# EAGLE schematic untitled (EAGLE 9.5.1)

## Sheet 1 of 3
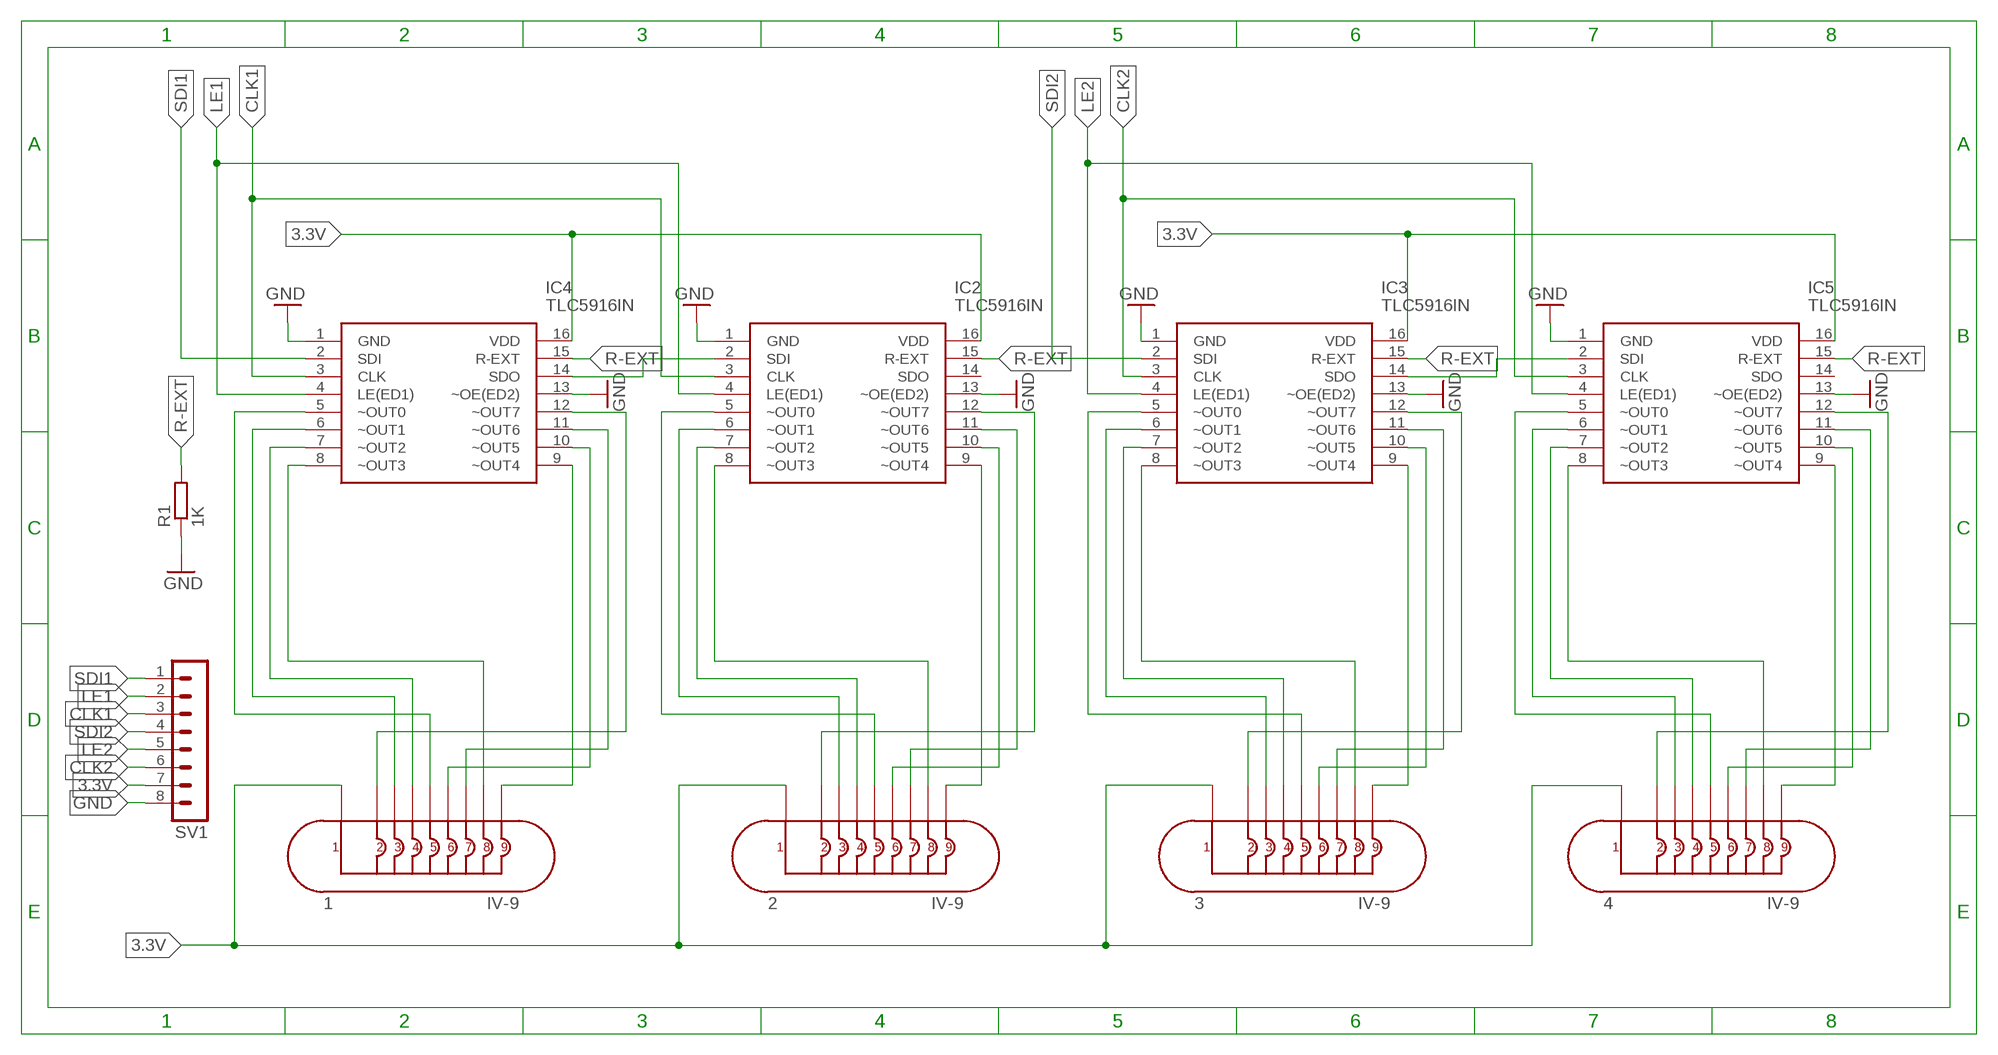
[diagram p0: schematic, sheet 1]

### Parts
1  IV-9  [IV-9]
2  IV-9  [IV-9]
3  IV-9  [IV-9]
4  IV-9  [IV-9]
IC2  TLC5916IN  [DIP254P762X508-16]
IC3  TLC5916IN  [DIP254P762X508-16]
IC4  TLC5916IN  [DIP254P762X508-16]
IC5  TLC5916IN  [DIP254P762X508-16]
R1  1K  R-EU_R1206  [R1206]
SV1  MA08-1  [MA08-1]

### Nets
3.3V: 1.1 2.1 3.1 4.1 IC2.16(VDD) IC3.16(VDD) IC4.16(VDD) IC5.16(VDD) SV1.7
CLK1 [other]: IC2.3(CLK) IC4.3(CLK) SV1.3
CLK2 [other]: IC3.3(CLK) IC5.3(CLK) SV1.6
GND: IC2.1(GND) IC2.13(~OE(ED2)) IC3.1(GND) IC3.13(~OE(ED2)) IC4.1(GND) IC4.13(~OE(ED2)) IC5.1(GND) IC5.13(~OE(ED2)) R1.1 SV1.8
LE1 [other]: IC2.4(LE(ED1)) IC4.4(LE(ED1)) SV1.2
LE2 [other]: IC3.4(LE(ED1)) IC5.4(LE(ED1)) SV1.5
N$7 [other]: IC3.14(SDO) IC5.2(SDI)
N$9 [other]: IC2.2(SDI) IC4.14(SDO)
N$13 [other]: 2.8 IC2.8(~OUT3)
N$15 [other]: 1.5 IC4.5(~OUT0)
N$16 [other]: 1.3 IC4.6(~OUT1)
N$17 [other]: 1.4 IC4.7(~OUT2)
N$18 [other]: 1.8 IC4.8(~OUT3)
N$19 [other]: 1.9 IC4.9(~OUT4)
N$20 [other]: 1.6 IC4.10(~OUT5)
N$21 [other]: 1.7 IC4.11(~OUT6)
N$22 [other]: 3.5 IC3.5(~OUT0)
N$23 [other]: 3.3 IC3.6(~OUT1)
N$24 [other]: 3.4 IC3.7(~OUT2)
N$25 [other]: 3.6 IC3.10(~OUT5)
N$26 [other]: 3.7 IC3.11(~OUT6)
N$27 [other]: 3.2 IC3.12(~OUT7)
N$28 [other]: 4.5 IC5.5(~OUT0)
N$29 [other]: 4.3 IC5.6(~OUT1)
N$30 [other]: 2.9 IC2.9(~OUT4)
N$31 [other]: 3.8 IC3.8(~OUT3)
N$32 [other]: 3.9 IC3.9(~OUT4)
N$35 [other]: 4.8 IC5.8(~OUT3)
N$36 [other]: 4.9 IC5.9(~OUT4)
N$66 [other]: 1.2 IC4.12(~OUT7)
N$67 [other]: 2.5 IC2.5(~OUT0)
N$68 [other]: 2.3 IC2.6(~OUT1)
N$69 [other]: 2.4 IC2.7(~OUT2)
N$70 [other]: 2.6 IC2.10(~OUT5)
N$71 [other]: 2.7 IC2.11(~OUT6)
N$72 [other]: 2.2 IC2.12(~OUT7)
N$73 [other]: 4.4 IC5.7(~OUT2)
N$74 [other]: 4.6 IC5.10(~OUT5)
N$75 [other]: 4.7 IC5.11(~OUT6)
N$76 [other]: 4.2 IC5.12(~OUT7)
R-EXT: IC2.15(R-EXT) IC3.15(R-EXT) IC4.15(R-EXT) IC5.15(R-EXT) R1.2
SDI1 [other]: IC4.2(SDI) SV1.1
SDI2 [other]: IC3.2(SDI) SV1.4
Unconnected: IC2.14(SDO) IC5.14(SDO)

## Sheet 2 of 3
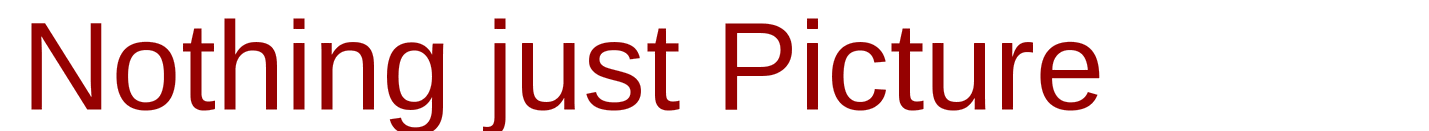
[diagram p1: schematic, sheet 2]

### Notes on the sheet
- Nothing just Picture

## Sheet 3 of 3

## Library data of the parts
1-4 = domestichacks:IV-9
IC2-IC5 = TLC5916IN:TLC5916IN: 8-CHANNEL CONSTANT-CURRENT LED SINK DRIVERS Source: Datasheet <http://www.ti.com/lit/gpn/tlc5916>; DESCRIPTION: 8-CHANNEL CONSTANT-CURRENT LED SINK DRIVERS; HEIGHT: mm; MANUFACTURER_NAME: Texas Instruments; MANUFACTURER_PART_NUMBER: TLC5916IN; MOUSER_PART_NUMBER: 595-TLC5916IN; MOUSER_PRICE-STOCK: https://www.mouser.com/Search/Refine.aspx?Keyword=595-TLC5916IN
R1 = rcl:R-EU_: RESISTOR, European symbol; SPICEPREFIX: R
SV1 = con-lstb:MA08-1: PIN HEADER; OC_FARNELL: unknown; OC_NEWARK: unknown

## Net classes
0 default: width 0.2 mm, drill 0.6 mm, clearance 0.2 mm
1 other: width 0.2 mm, drill 0.2 mm, clearance 0.1 mm